# Altium schematic sheet ESP32.SchDoc
size A; SheetNumber: 2; SheetTotal: 8
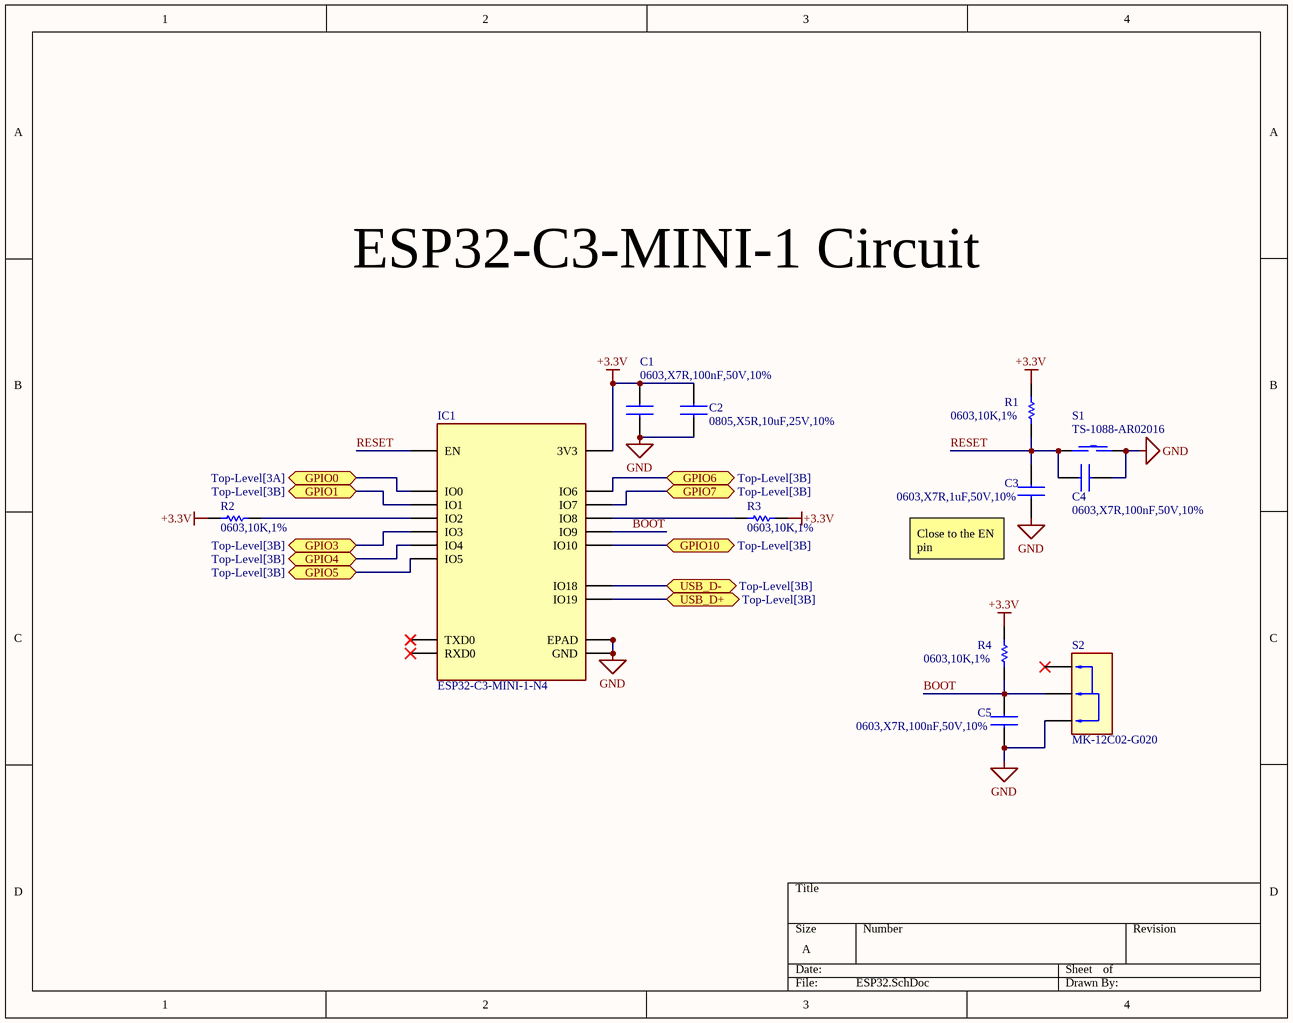
[diagram p0: ESP32.SchDoc]

## Parts
C1  0603,X7R,100nF,50V,10%  [CAPC1608X90N]
C2  0805,X5R,10uF,25V,10%  [CAPC2012X145N]
C3  0603,X7R,1uF,50V,10%  [CAPC1608X90N]
C4  0603,X7R,100nF,50V,10%  [CAPC1608X90N]
C5  0603,X7R,100nF,50V,10%  [CAPC1608X90N]
IC1  ESP32-C3-MINI-1-N4  [ESP32C3MINI1N4]
R1  0603,10K,1%  [RESC1608X55N]
R2  0603,10K,1%  [RESC1608X55N]
R3  0603,10K,1%  [RESC1608X55N]
R4  0603,10K,1%  [RESC1608X55N]
S1  TS-1088-AR02016  [SW-SMD_L3.9-W3.0-P4.45]
S2  MK-12C02-G020  [SW-SMD_MK-12C02-G020]

## Ports
GPIO0 (bidir, see Top-Level[3A]), GPIO1 (bidir, see Top-Level[3B]), GPIO3 (bidir, see Top-Level[3B]), GPIO4 (bidir, see Top-Level[3B]), GPIO5 (bidir, see Top-Level[3B]), GPIO6 (bidir, see Top-Level[3B]), GPIO7 (bidir, see Top-Level[3B]), GPIO10 (bidir, see Top-Level[3B]), USB_D+ (bidir, see Top-Level[3B]), USB_D- (bidir, see Top-Level[3B])

## Nets
+3.3V: C1.2 C2.2 IC1.3(3V3) R1.2 R2.2 R3.2 R4.2
GND: C1.1 C2.1 C3.1 C4.1 C5.2 IC1.1(GND) IC1.2(GND) IC1.11(GND) IC1.14(GND) IC1.36(GND) IC1.37(GND) IC1.38(GND) IC1.39(GND) IC1.40(GND) IC1.41(GND) IC1.42(GND) IC1.43(GND) IC1.44(GND) IC1.45(GND) IC1.46(GND) IC1.47(GND) IC1.48(GND) IC1.49(EPAD) IC1.50(EPAD) IC1.51(EPAD) IC1.52(EPAD) IC1.53(EPAD) IC1.54(EPAD) IC1.55(EPAD) IC1.56(EPAD) IC1.57(EPAD) IC1.58(GND) IC1.59(GND) IC1.60(GND) IC1.61(GND) S1.1 S2.3
BOOT: C5.1 IC1.23(IO9) R4.1 S2.2
GPIO0: IC1.12(IO0) ; port GPIO0
GPIO1: IC1.13(IO1) ; port GPIO1
GPIO3: IC1.6(IO3) ; port GPIO3
GPIO4: IC1.18(IO4) ; port GPIO4
GPIO5: IC1.19(IO5) ; port GPIO5
GPIO6: IC1.20(IO6) ; port GPIO6
GPIO7: IC1.21(IO7) ; port GPIO7
GPIO10: IC1.16(IO10) ; port GPIO10
RESET: C3.2 C4.2 IC1.8(EN) R1.1 S1.2
USB_D+: IC1.27(IO19) ; port USB_D+
USB_D-: IC1.26(IO18) ; port USB_D-
NetIC1_5: IC1.5(IO2) R2.1
NetIC1_22: IC1.22(IO8) R3.1

Not connected (* = marked no-connect by the designer): IC1 30(RXD0)* 31(TXD0)*; S2 1*

## Notes on the sheet
- ESP32-C3-MINI-1 Circuit
- (near C3) Close to the EN pin

## Library data of the parts
C1 C4 C5 = CC0603KRX7R9BB104: 50V 100nF X7R ±10% 0603 Multilayer Ceramic Capacitors MLCC - SMD/SMT ROHS; Manufacturer_Name: YAGEO; Datasheet Link: https://componentsearchengine.com/Datasheets/2/CC0603KRX7R9BB104.pdf; Height: 0.9mm; Manufacturer_Part_Number: CC0603KRX7R9BB104; Mouser Part Number: 603-CC603KRX7R9BB104; Mouser Price/Stock: https://www.mouser.co.uk/ProductDetail/YAGEO/CC0603KRX7R9BB104?qs=vTakOoo5QyLvVCYM2ge8LQ%3D%3D; Arrow Part Number: CC0603KRX7R9BB104; Arrow Price/Stock: https://www.arrow.com/en/products/cc0603krx7r9bb104/yageo?utm_currency=USD&region=europe; JLCPCB Part #: C14663; LCSC Part Number: C14663
C2 = CC0805KKX5R8BB106: 10 µF ±10% 25V Ceramic Capacitor X5R 0805 (2012 Metric); Manufacturer_Name: YAGEO; Datasheet Link: https://www.yageo.com/upload/media/product/productsearch/datasheet/mlcc/UPY-GPHC_X5R_4V-to-50V_27.pdf; Height: 1.45mm; Manufacturer_Part_Number: CC0805KKX5R8BB106; Mouser Part Number: 603-CC805KKX5R8BB106; Mouser Price/Stock: https://www.mouser.co.uk/ProductDetail/YAGEO/CC0805KKX5R8BB106?qs=57cj7OiSijm89pM64t1AGQ%3D%3D; Arrow Part Number: CC0805KKX5R8BB106; Arrow Price/Stock: https://www.arrow.com/en/products/cc0805kkx5r8bb106/yageo?utm_currency=USD&region=nac; LCSC Part Number: C89831
C3 = CC0603KRX7R9BB105: 50V 1uF X7R ±10% 0603 Multilayer Ceramic Capacitors MLCC - SMD/SMT ROHS; Manufacturer_Name: YAGEO; Datasheet Link: https://www.yageo.com/upload/media/product/app/datasheet/mlcc/upy-gphc_x7r_6_3v-to-250v.pdf; Height: 0.95mm; Manufacturer_Part_Number: CC0603KRX7R9BB105; Mouser Part Number: 603-CC603KRX7R9BB105; Mouser Price/Stock: https://www.mouser.co.uk/ProductDetail/YAGEO/CC0603KRX7R9BB105?qs=6wERJjOp3mmF17%252BYi8cgJQ%3D%3D; Arrow Part Number: CC0603KRX7R9BB105; Arrow Price/Stock: https://www.arrow.com/en/products/cc0603krx7r9bb105/yageo?utm_currency=USD&region=nac; LCSC Part Number: C559769
IC1 = ESP32-C3-MINI-1-N4: Small-sized 2.4 GHz Wi-Fi (802.11b/g/n) and Bluetooth® 5 module / Built around ESP32-C3 series of SoCs, RISC-V single-core microprocessor / 4 MB flash in chip package / 15 GPIOs / On-board PCB antenna or external antenna connector; Manufacturer_Name: Espressif Systems; Datasheet Link: https://www.mouser.com/datasheet/2/891/Espressif_ESP32_C3_MINI_1_Datasheet-2006822.pdf; Height: 2.55mm; Manufacturer_Part_Number: ESP32-C3-MINI-1-N4; Mouser Part Number: 356-ESP32-C3-MINI1N4; Mouser Price/Stock: https://www.mouser.co.uk/ProductDetail/Espressif-Systems/ESP32-C3-MINI-1-N4?qs=stqOd1AaK7%252B%2FpH3qqyGehA%3D%3D; LCSC Part Number: C2838502
R1-R4 = RC0603FR-0710KL: 100mW Thick Film Resistor 75V ±100ppm/℃ ±1% 10kΩ 0603 Chip Resistor - Surface Mount ROHS; Manufacturer_Name: YAGEO; Datasheet Link: https://www.mouser.in/datasheet/2/447/PYu_RC_Group_51_RoHS_L_11-1984063.pdf; Height: 0.55mm; Manufacturer_Part_Number: RC0603FR-0710KL; Mouser Part Number: 603-RC0603FR-0710KL; Mouser Price/Stock: https://www.mouser.co.uk/ProductDetail/YAGEO/RC0603FR-0710KL?qs=grNVn54RoB%252B3GtjbJj3wJQ%3D%3D; Arrow Part Number: RC0603FR-0710KL; Arrow Price/Stock: https://www.arrow.com/en/products/rc0603fr-0710kl/yageo?utm_currency=USD&region=nac; LCSC Part Number: C98220
S1 = TS-1088-AR02016: Without Bracket 50mA 4mm 100,000 Cycles 12V 1.6N 3mm 2mm Round Button Surface Mount,Vertical SPST SMD Tactile Switches ROHS; LCSC Part Number: C720477
S2 = MK-12C02-G020: Surface Mount, Right Angle 1A SPDT 6V Black 10,000 Cycles SMD Slide Switches ROHS; LCSC Part Number: C963206